# EAGLE schematic modulo_cortina (EAGLE 8.3.1)
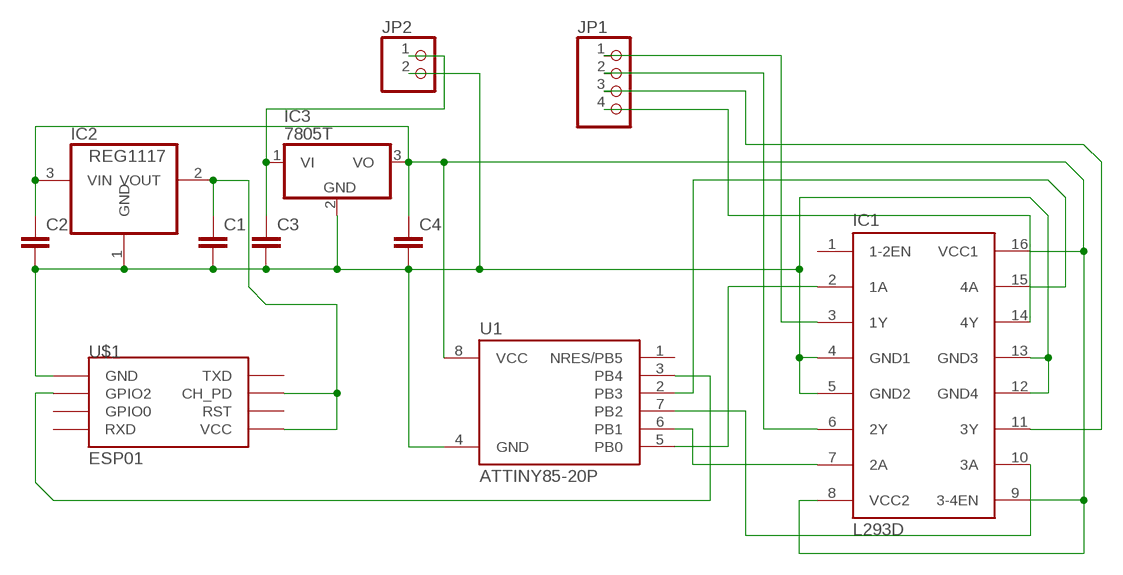
[diagram p0: schematic, sheet 1]

## Parts
C1  C2,5-3  [C2.5-3]
C2  C2,5-3  [C2.5-3]
C3  C2,5-3  [C2.5-3]
C4  C2,5-3  [C2.5-3]
IC1  L293D  [DIL16]
IC2  REG1117  [SOT223]
IC3  7805T  [TO220H]
JP1  PINHD-1X4  [1X04]
JP2  PINHD-1X2  [1X02]
U1  ATTINY85-20P  [PDIP08_300MIL]
U$1  ESP01  [ESP01]

## Nets
N$1: C1.1 IC2.2(VOUT) U$1.CH_PD U$1.VCC
N$2: C3.1 IC3.1(VI) JP2.1
N$3: IC1.10(3A) U1.7(PB2)
N$4: IC1.2(1A) U1.5(PB0)
N$6: U1.3(PB4) U$1.GPIO2
N$7: IC1.3(1Y) JP1.1
N$8: IC1.6(2Y) JP1.2
N$9: IC1.11(3Y) JP1.3
N$10: C2.1 C4.1 IC1.8(VCC2) IC1.9(3-4EN) IC1.16(VCC1) IC2.3(VIN) IC3.3(VO) U1.8(VCC)
N$11: IC1.14(4Y) JP1.4
N$12: IC1.7(2A) U1.6(PB1)
N$13: IC1.15(4A) U1.2(PB3)
N$16: C1.2 C2.2 C3.2 C4.2 IC1.4(GND1) IC1.5(GND2) IC1.12(GND4) IC1.13(GND3) IC2.1(GND) IC3.2(GND) JP2.2 U1.4(GND) U$1.GND
Unconnected: IC1.1(1-2EN) U1.1(NRES/PB5) U$1.GPIO0 U$1.RST U$1.RX(RXD) U$1.TX(TXD)

## Library data of the parts
C1-C4 = capacitor-wima:C: CAPACITOR naming: grid - package width
IC1 = st-microelectronics:L293D: PUSH-PULL 4 CHANNEL DRIVER; MPN: L293D; OC_FARNELL: 9589619; OC_NEWARK: 56P8249
IC2 = burr-brown:REG1117: 800mA and 1A Low Dropout (LDO) Positive Regulator 1.8V, 2.5V, 2.85V, 3.3V, 5V, and Adj; MPN: REG1117; OC_FARNELL: 1097566; OC_NEWARK: 14P6981
IC3 = linear:78*: Positive VOLTAGE REGULATOR Source: http://cache.national.com/ds/LM/LM78L05.pdf http://www.fairchildsemi.com/ds/LM/LM7805.pdf
JP1 = pinhead:PINHD-1X4: PIN HEADER
JP2 = pinhead:PINHD-1X2: PIN HEADER
U1 = _hhn_attiny25_45_85:ATTINY85*: ATMEL ATtiny 85 Packages: P = PDIP 08 30mil S = SOIC 08 EIAJ 208mil Technologies Note: for complete ordering code (temp. range, finish, tape&reel etc.) see www.atmel.com • Supply Voltage: V = (1.8…5.5)V | [blank] = (2.7…5.5)V • Speed: 10 = 10 MHz | 20 = 20 MHz Author: Dipl.-Ing. FH Rainer Bayer HHN Hochschule Heilbronn (Heilbronn University), rainer.bayer@hs-heilbronn.de Ingenieurbüro ing-rb, mail@ing-rb.de
U$1 = esp8266modules:ESP01: ESP8266 Wifi module 01